# EAGLE design Controller V1 (EAGLE 9.3.2)
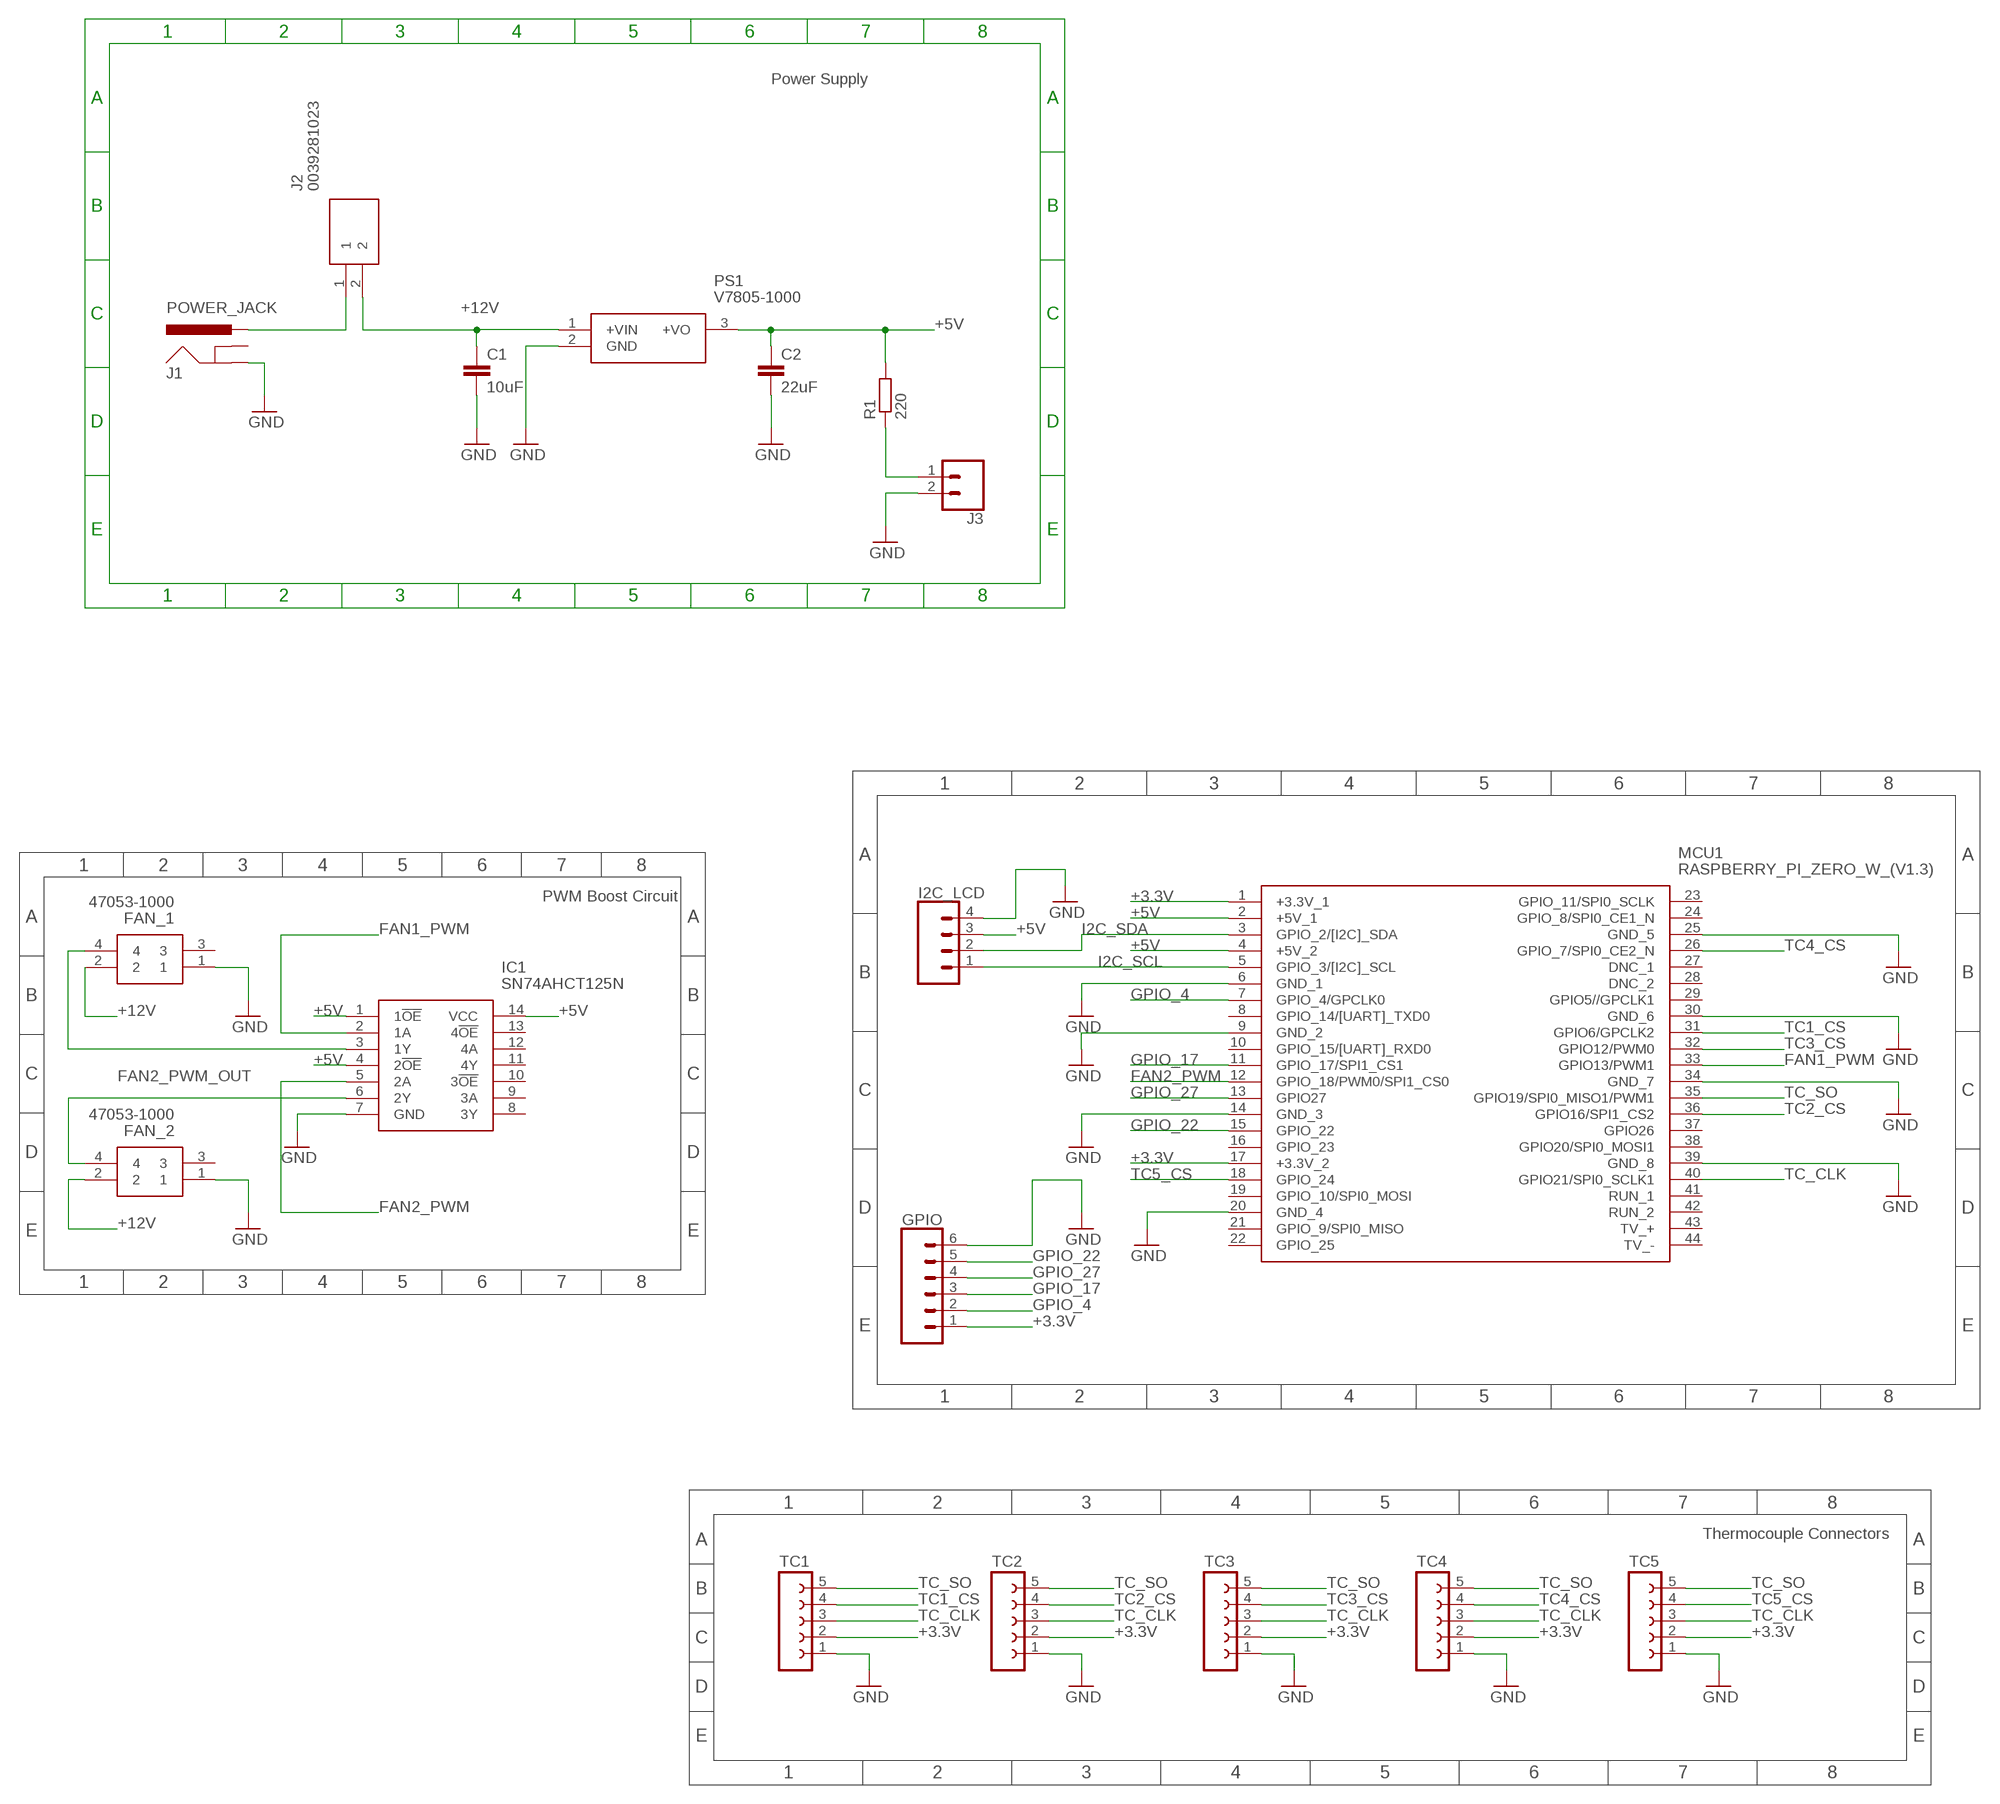
[diagram p0: schematic, sheet 1]

## Parts
C1  10uF  C-EU050-024X044  [C050-024X044]
C2  22uF  C-EU050-024X044  [C050-024X044]
FAN_1  47053-1000  [47053-1000]
FAN_2  47053-1000  [47053-1000]
GPIO  CONN_06SILK_FEMALE_PTH  [1X06]
I2C_LCD  CONN_04PTH  [1X04]
IC1  SN74AHCT125N  [DIP794W53P254L1930H508Q14N]
J1  POWER_JACK  [POWER_JACK_PTH]
J2  0039281023  [SHDR2W145P0X550_1X2_960X540X13]
J3  CONN_02  [1X02]
MCU1  RASPBERRY_PI_ZERO_W_(V1.3)  [RASPBERRYPIZEROWV13]
PS1  V7805-1000  [V78031500]
R1  220  R-EU_0309/10  [0309/10]
TC1  FE05-1  [FE05-1]
TC2  FE05-1  [FE05-1]
TC3  FE05-1  [FE05-1]
TC4  FE05-1  [FE05-1]
TC5  FE05-1  [FE05-1]

## Nets
+3.3V: GPIO.1 MCU1.1(+3.3V_1) MCU1.17(+3.3V_2) TC1.2 TC2.2 TC3.2 TC4.2 TC5.2
+5V: C2.1 I2C_LCD.3 IC1.1(1!OE) IC1.4(2!OE) IC1.14(VCC) MCU1.2(+5V_1) MCU1.4(+5V_2) PS1.3(+VO) R1.2
+12V: C1.1 FAN_1.2 FAN_2.2 J2.2 PS1.1(+VIN)
FAN1_PWM: IC1.2(1A) MCU1.33(GPIO13/PWM1)
FAN2_PWM: IC1.5(2A) MCU1.12(GPIO_18/PWM0/SPI1_CS0)
FAN2_PWM_OUT: FAN_2.4 IC1.6(2Y)
FAN!_PWM_OUT: FAN_1.4 IC1.3(1Y)
GND: C1.2 C2.2 FAN_1.1 FAN_2.1 GPIO.6 I2C_LCD.4 IC1.7(GND) J1.GND J3.2 MCU1.6(GND_1) MCU1.9(GND_2) MCU1.14(GND_3) MCU1.20(GND_4) MCU1.25(GND_5) MCU1.30(GND_6) MCU1.34(GND_7) MCU1.39(GND_8) PS1.2(GND) TC1.1 TC2.1 TC3.1 TC4.1 TC5.1
GPIO_4: GPIO.2 MCU1.7(GPIO_4/GPCLK0)
GPIO_17: GPIO.3 MCU1.11(GPIO_17/SPI1_CS1)
GPIO_22: GPIO.5 MCU1.15(GPIO_22)
GPIO_27: GPIO.4 MCU1.13(GPIO27)
I2C_SCL: I2C_LCD.1 MCU1.5(GPIO_3/[I2C]_SCL)
I2C_SDA: I2C_LCD.2 MCU1.3(GPIO_2/[I2C]_SDA)
N$1: J3.1 R1.1
TC1_CS: MCU1.31(GPIO6/GPCLK2) TC1.4
TC2_CS: MCU1.36(GPIO16/SPI1_CS2) TC2.4
TC3_CS: MCU1.32(GPIO12/PWM0) TC3.4
TC4_CS: MCU1.26(GPIO_7/SPI0_CE2_N) TC4.4
TC5_CS: MCU1.18(GPIO_24) TC5.4
TC_CLK: MCU1.40(GPIO21/SPI0_SCLK1) TC1.3 TC2.3 TC3.3 TC4.3 TC5.3
TC_SO: MCU1.35(GPIO19/SPI0_MISO1/PWM1) TC1.5 TC2.5 TC3.5 TC4.5 TC5.5
VIN: J1.PWR J2.1
Unconnected: FAN_1.3 FAN_2.3 IC1.8(3Y) IC1.9(3A) IC1.10(3!OE) IC1.11(4Y) IC1.12(4A) IC1.13(4!OE) J1.GNDBREAK MCU1.8(GPIO_14/[UART]_TXD0) MCU1.10(GPIO_15/[UART]_RXD0) MCU1.16(GPIO_23) MCU1.19(GPIO_10/SPI0_MOSI) MCU1.21(GPIO_9/SPI0_MISO) MCU1.22(GPIO_25) MCU1.23(GPIO_11/SPI0_SCLK) MCU1.24(GPIO_8/SPI0_CE1_N) MCU1.27(DNC_1) MCU1.28(DNC_2) MCU1.29(GPIO5//GPCLK1) MCU1.37(GPIO26) MCU1.38(GPIO20/SPI0_MOSI1) MCU1.41(RUN_1) MCU1.42(RUN_2) MCU1.43(TV_+) MCU1.44(TV_-)

## Notes on the sheet
- Power Supply
- PWM Boost Circuit
- Thermocouple Connectors

## Library data of the parts
C1 C2 = rcl:C-EU: CAPACITOR, European symbol; SPICEPREFIX: C
FAN_1 FAN_2 = SamacSys_Parts:47053-1000: MOLEX - 47053-1000 - HEADER, 4POS, 1ROW, 2.54MM Source: Datasheet <https://componentsearchengine.com/Datasheets/1/47053-1000.pdf>; DESCRIPTION: MOLEX - 47053-1000 - HEADER, 4POS, 1ROW, 2.54MM; HEIGHT: mm; MANUFACTURER_NAME: Molex; MANUFACTURER_PART_NUMBER: 47053-1000; MOUSER_PART_NUMBER: 538-47053-1000; MOUSER_PRICE-STOCK: https://www.mouser.com/Search/Refine.aspx?Keyword=538-47053-1000
GPIO = SparkFun-Connectors:CONN_06: Multi connection point. Often used as Generic Header-pin footprint for 0.1 inch spaced/style header connections On any of the 0.1 inch spaced packages, you can populate with these: Break Away Headers - Straight <https://www.sparkfun.com/products/116> (PRT-00116) Break Away Male Headers - Right Angle <https://www.sparkfun.com/products/553> (PRT-00553) Female Headers <https://www.sparkfun.com/products/115> (PRT-00115) Break Away Headers - Machine Pin <https://www.sparkfun.com/products/117> (PRT-00117) Break Away Female Headers - Swiss Machine Pin <https://www.sparkfun.com/products/743> (PRT-00743) Arduino Stackable Header - 6 Pin <https://www.sparkfun.com/products/9280> (PRT-09280) For SCREWTERMINALS and SPRING TERMINALS visit here: Screw Terimnals on SparkFun.com <https://www.sparkfun.com/search/results?term=Screw+Terminals> (5mm/3.5mm/2.54mm spacing) This device is also useful as a general connection point to wire up your design to another part of your project. Our various solder wires solder well into these plated through hole pads. Hook-Up Wire - Assortment (Stranded, 22 AWG) <https://www.sparkfun.com/products/11375> (PRT-11375) Hook-Up Wire - Assortment (Solid Core, 22 AWG) <https://www.sparkfun.com/products/11367> (PRT-11367) View the entire wire category on our website here <https://www.sparkfun.com/categories/141>; PROD_ID: CONN-08437
I2C_LCD = SparkFun-Connectors:CONN_04: Multi connection point. Often used as Generic Header-pin footprint for 0.1 inch spaced/style header connections On any of the 0.1 inch spaced packages, you can populate with these: Break Away Headers - Straight <https://www.sparkfun.com/products/116> (PRT-00116) Break Away Male Headers - Right Angle <https://www.sparkfun.com/products/553> (PRT-00553) Female Headers <https://www.sparkfun.com/products/115> (PRT-00115) Break Away Headers - Machine Pin <https://www.sparkfun.com/products/117> (PRT-00117) Break Away Female Headers - Swiss Machine Pin <https://www.sparkfun.com/products/743> (PRT-00743) For SCREWTERMINALS and SPRING TERMINALS visit here: Screw Terimnals on SparkFun.com <https://www.sparkfun.com/search/results?term=Screw+Terminals> (5mm/3.5mm/2.54mm spacing) This device is also useful as a general connection point to wire up your design to another part of your project. Our various solder wires solder well into these plated through hole pads. Hook-Up Wire - Assortment (Stranded, 22 AWG) <https://www.sparkfun.com/products/11375> (PRT-11375) Hook-Up Wire - Assortment (Solid Core, 22 AWG) <https://www.sparkfun.com/products/11367> (PRT-11367) View the entire wire category on our website here <https://www.sparkfun.com/categories/141> Special notes: Molex polarized connector foot print use with SKU : PRT-08231 with associated crimp pins and housings. 1MM SMD Version SKU: PRT-10208; PROD_ID: CONN-09696
IC1 = SamacSys_Parts:SN74AHCT125N: Quadruple Bus Buffer Gates With 3-State Outputs Source: Datasheet <http://www.ti.com/lit/gpn/sn74ahct125>; DESCRIPTION: Quadruple Bus Buffer Gates With 3-State Outputs; HEIGHT: 5.08mm; MANUFACTURER_NAME: Texas Instruments; MANUFACTURER_PART_NUMBER: SN74AHCT125N; MOUSER_PART_NUMBER: 595-SN74AHCT125N; MOUSER_PRICE-STOCK: https://www.mouser.com/Search/Refine.aspx?Keyword=595-SN74AHCT125N
J1 = SparkFun-Connectors:POWER_JACK: Power Jack Connector This is the standard 5.5mm barrel jack for power. The PTH is the most common, proven, reliable, footprint. The Slot footprint only works if the mill layer is transmitted to the PCB fab house so be warned. Here are the connectors we sell at SparkFun: DC Barrel Power Jack/Connector <https://www.sparkfun.com/products/119> (PRT-00119) DC Barrel Power Jack/Connector (SMD) <https://www.sparkfun.com/products/12748> (PRT-12748) DC Barrel Jack Adapter - Breadboard Compatible <https://www.sparkfun.com/products/10811> (PRT-10811) It is used on this SparkFun product (and many, many others): SparkFun RedBoard - Programmed with Arduino <https://www.sparkfun.com/products/12757> (DEV-12757) Also, if you need a mating power supply or connector, please check these out: Wall Adapter Power Supply - 9VDC 650mA <https://www.sparkfun.com/products/298> (TOL-00298) DC Barrel Jack Adapter - Male <https://www.sparkfun.com/products/10287> (PRT-10287); PROD_ID: CONN-08197
J2 = SamacSys_Parts:0039281023: Mini-Fit Jr. Vertical Header, 4.20mm Pitch, Dual Row, 2 Circuits, without Snap-in Plastic Peg PCB Lock, Tin, Natural Source: Datasheet <https://componentsearchengine.com/Datasheets/1/0039281023.pdf>; DESCRIPTION: Mini-Fit Jr. Vertical Header, 4.20mm Pitch, Dual Row, 2 Circuits, without Snap-in Plastic Peg PCB Lock, Tin, Natural; HEIGHT: 13.1mm; MANUFACTURER_NAME: Molex; MANUFACTURER_PART_NUMBER: 0039281023; MOUSER_PART_NUMBER: N/A; MOUSER_PRICE-STOCK: https://www.mouser.com/Search/Refine.aspx?Keyword=N%2FA
J3 = SparkFun-Connectors:CONN_02: Multi connection point. Often used as Generic Header-pin footprint for 0.1 inch spaced/style header connections On any of the 0.1 inch spaced packages, you can populate with these: Break Away Headers - Straight <https://www.sparkfun.com/products/116> (PRT-00116) Break Away Male Headers - Right Angle <https://www.sparkfun.com/products/553> (PRT-00553) Female Headers <https://www.sparkfun.com/products/115> (PRT-00115) Break Away Headers - Machine Pin <https://www.sparkfun.com/products/117> (PRT-00117) Break Away Female Headers - Swiss Machine Pin <https://www.sparkfun.com/products/743> (PRT-00743) For SCREWTERMINALS and SPRING TERMINALS visit here: Screw Terimnals on SparkFun.com <https://www.sparkfun.com/search/results?term=Screw+Terminals> (5mm/3.5mm/2.54mm spacing) This device is also useful as a general connection point to wire up your design to another part of your project. Our various solder wires solder well into these plated through hole pads. Hook-Up Wire - Assortment (Stranded, 22 AWG) <https://www.sparkfun.com/products/11375> (PRT-11375) Hook-Up Wire - Assortment (Solid Core, 22 AWG) <https://www.sparkfun.com/products/11367> (PRT-11367) View the entire wire category on our website here <https://www.sparkfun.com/categories/141> Special notes: Molex polarized connector foot print use with: PRT-08233 with associated crimp pins and housings. 2.54_SCREWTERM for use with PRT-10571. 3.5mm Screw Terminal footprints for PRT-08084 5mm Screw Terminal footprints for use with PRT-08432
MCU1 = SamacSys_Parts:RASPBERRY_PI_ZERO_W_(V1.3): Raspberry Pi Zero W (v1.3) Single-board Computers Source: Datasheet <https://cdn.sparkfun.com/assets/learn_tutorials/6/7/6/PiZero_1.pdf>; DESCRIPTION: Raspberry Pi Zero W (v1.3) Single-board Computers; HEIGHT: mm; MANUFACTURER_NAME: RASPBERRY-PI; MANUFACTURER_PART_NUMBER: Raspberry Pi Zero W (v1.3)
PS1 = SamacSys_Parts:V7805-1000: V7805-1000-SMT Non-Isolated DC/DC Converters Non-Isolated D C-DC Cnvrt. This is the SMT Version of the package. Source: Datasheet <https://componentsearchengine.com/Datasheets/1/V7805-1000.pdf>; DESCRIPTION: V7805-1000-SMT Non-Isolated DC/DC Converters Non-Isolated D C-DC Cnvrt. This is the SMT Version of the package.; HEIGHT: mm; MANUFACTURER_NAME: CUI; MANUFACTURER_PART_NUMBER: V7805-1000; MOUSER_PART_NUMBER: 490-V7805-1000; MOUSER_PRICE-STOCK: https://www.mouser.com/Search/Refine.aspx?Keyword=490-V7805-1000
R1 = rcl:R-EU_: RESISTOR, European symbol; SPICEPREFIX: R
TC1-TC5 = con-lsta:FE05-1: FEMALE HEADER; OC_FARNELL: unknown; OC_NEWARK: unknown

## Board
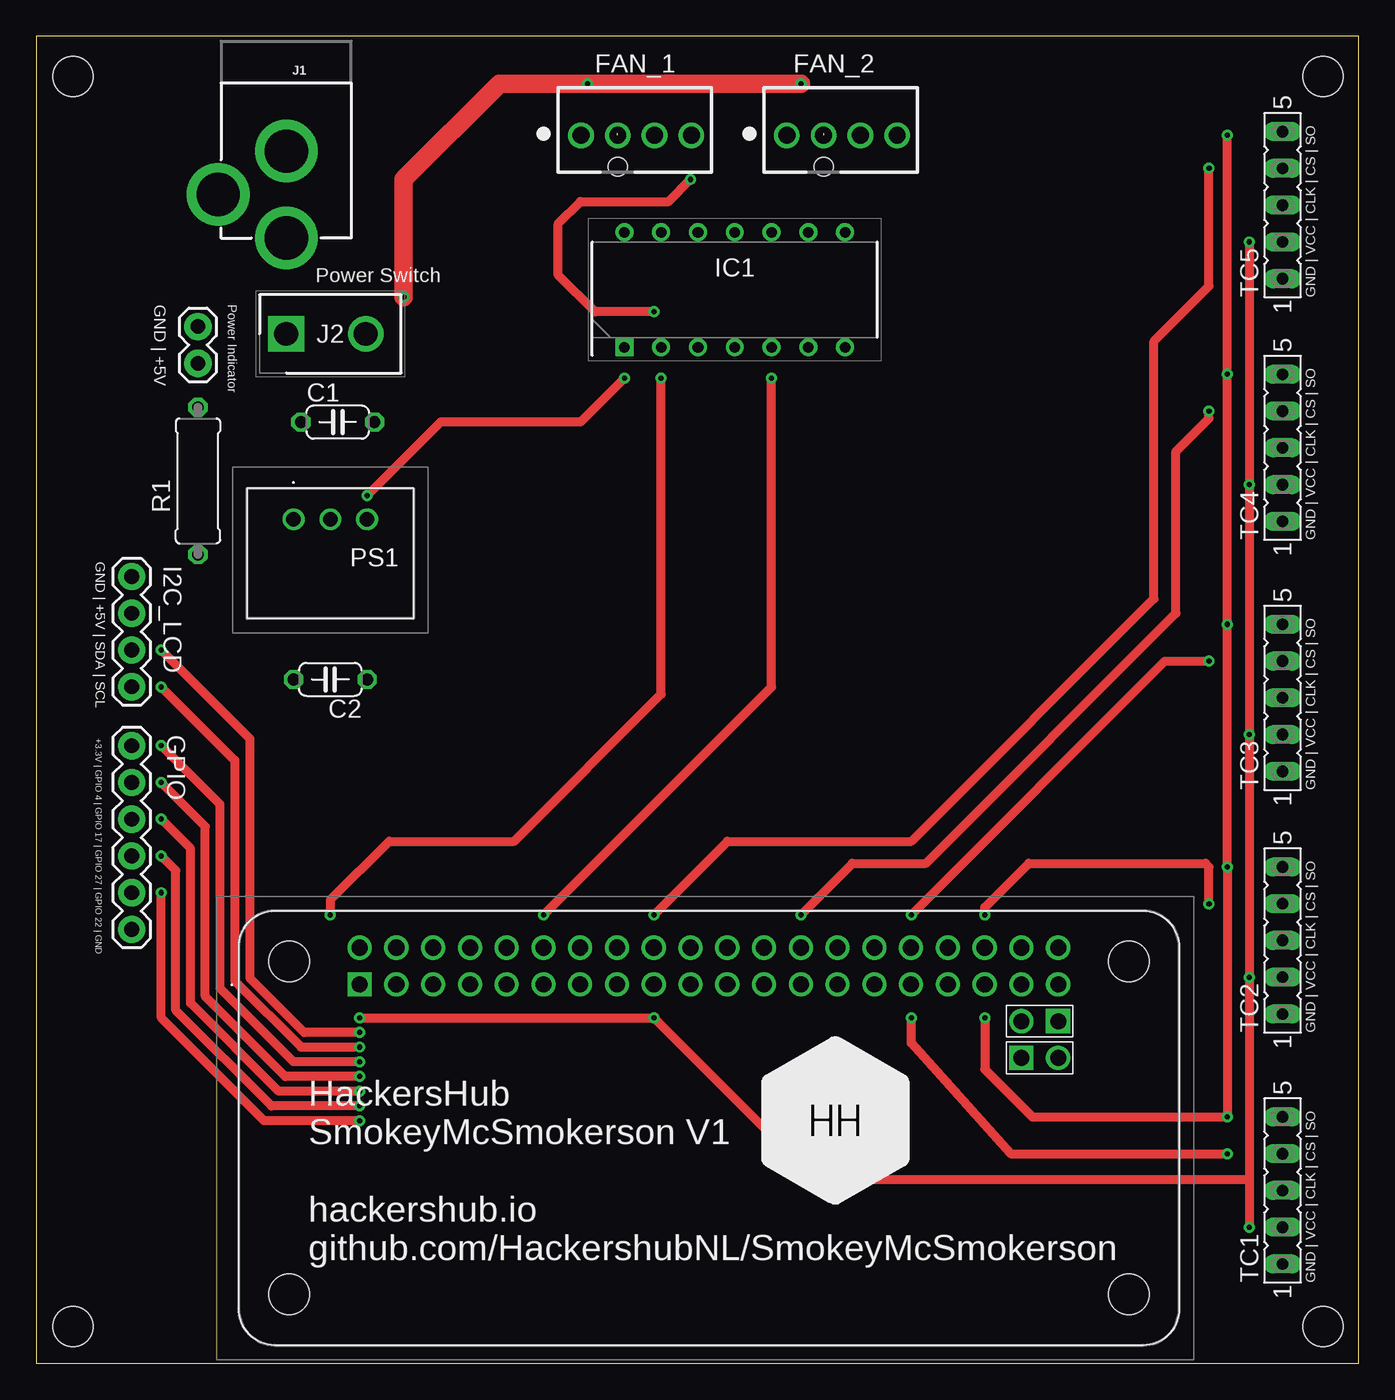
[diagram p1: board, top side]
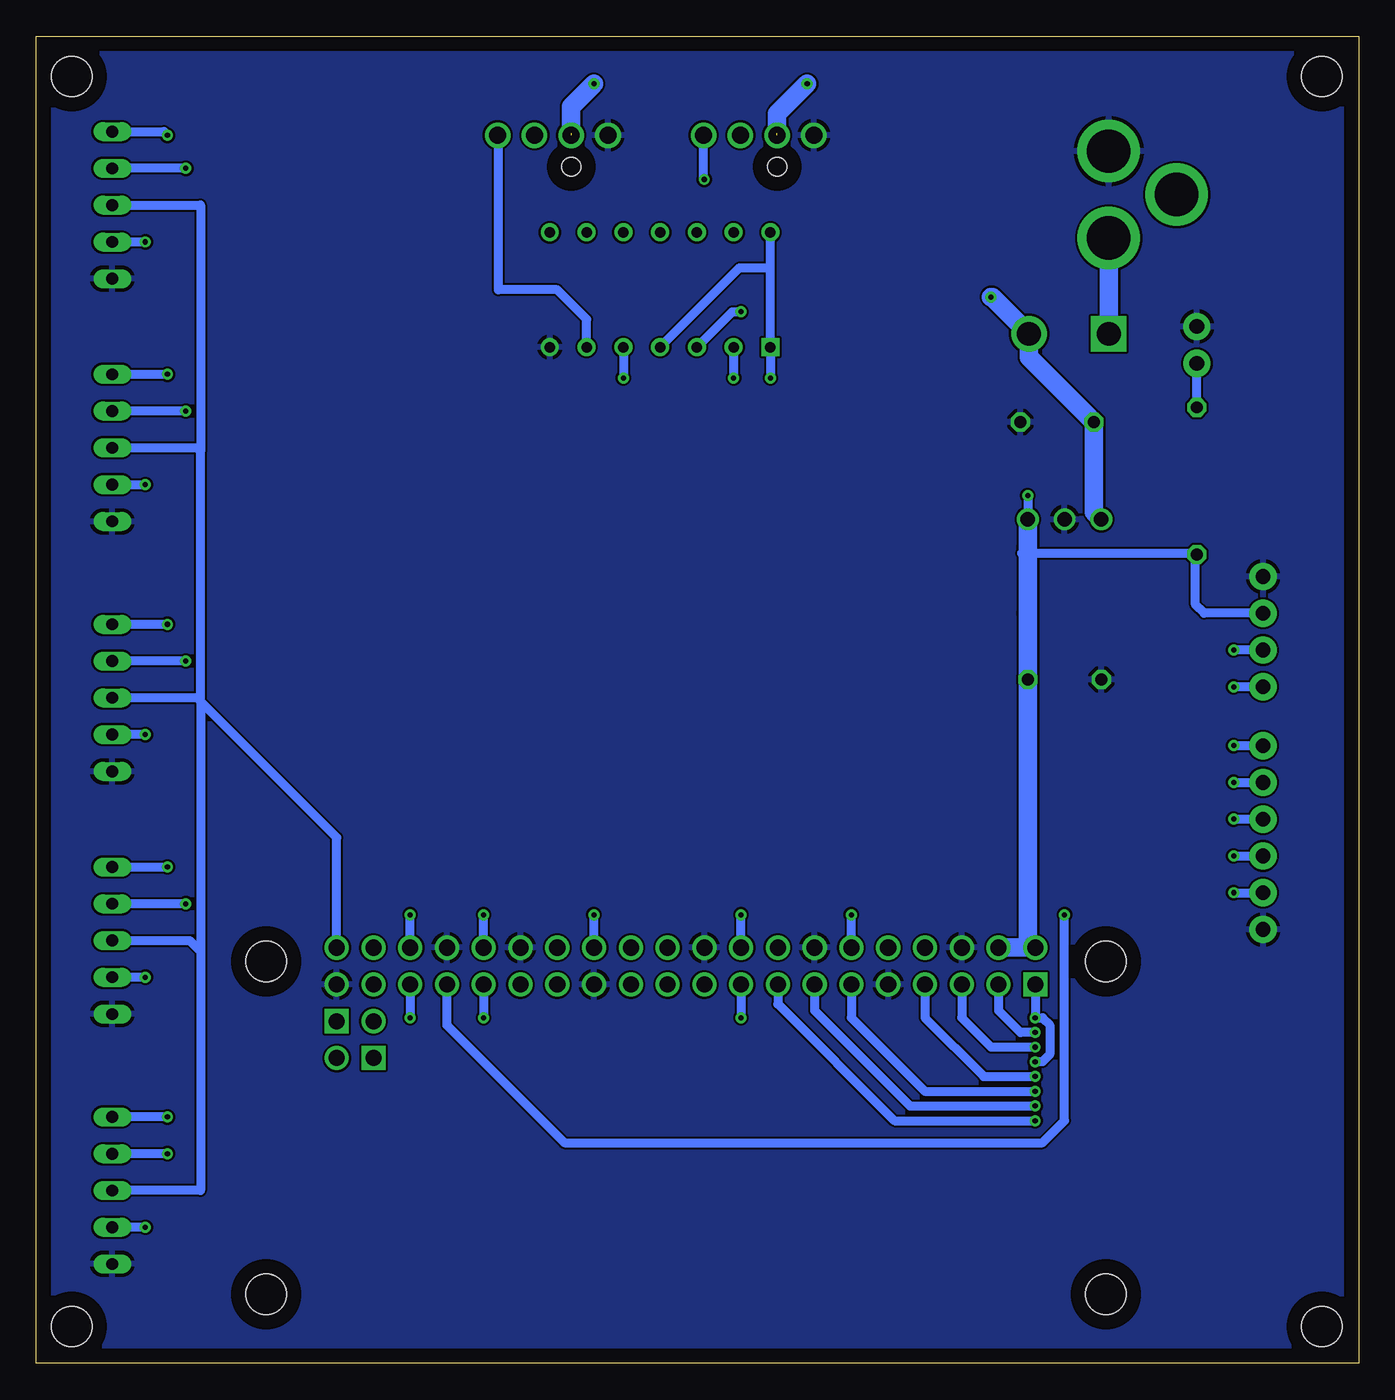
[diagram p2: board, bottom side, seen from below]

Size 91.36 x 91.68 mm. Coordinates in mm from the lower left corner, seen from the top.
Outline: 0,0 91.36,0 91.36,91.68 0,91.68 0,0
Copper layers (1*16): Top 0.035mm / dielectric 1.5mm / Bottom 0.035mm
Design rules "default": minimum track width 6mil, minimum drill 0.35mm, track to track 6mil, track to pad 6mil, pad to pad 6mil, via to via 6mil, smd to smd 6mil, copper to edge 40mil, drill to drill 6mil, minimum pad ring 10mil, minimum via ring 8mil, stop-mask expansion 4mil, vias tented up to drill 0mil, thermal gap 10mil
Holes 2.79 mm at 2.54,2.54 88.9,2.54 2.54,88.9 88.9,88.9

### Footprints (pad centres in the part's own frame; a part is rotated, then mirrored left to right if it is on the bottom)
C050-024X044 = drill 0.813 octagon: 1 -2.54,0; 2 2.54,0
47053-1000 = drill 1.17 pad 1.77: 1 1.57,2.54; 2 4.11,2.54; 3 6.65,2.54; 4 9.19,2.54 | hole 1.3: 4.11,0.38
1X06 = drill 1.016 pad 1.88: 1 0,0; 2 2.54,0; 3 5.08,0; 4 7.62,0; 5 10.16,0; 6 12.7,0
1X04 = drill 1.016 pad 1.88: 1 0,0; 2 2.54,0; 3 5.08,0; 4 7.62,0
DIP794W53P254L1930H508Q14N = drill 0.73 pad 1.13 square: 1 -3.97,7.62 | drill 0.73 pad 1.13: 2 -3.97,5.08; 3 -3.97,2.54; 4 -3.97,0; 5 -3.97,-2.54; 6 -3.97,-5.08; 7 -3.97,-7.62; 8 3.97,-7.62; 9 3.97,-5.08; 10 3.97,-2.54; 11 3.97,0; 12 3.97,2.54; 13 3.97,5.08; 14 3.97,7.62
POWER_JACK_PTH = drill 2.997 pad 4.318: GND 0,7.7; GNDBREAK 4.7,10.7; PWR 0,13.7
SHDR2W145P0X550_1X2_960X540X13 = drill 1.65 pad 2.475 square: 1 0,0 | drill 1.65 pad 2.475: 2 -5.5,0
1X02 = drill 1.016 pad 1.88: 1 0,0; 2 2.54,0
RASPBERRYPIZEROWV13 = drill 1.11 pad 1.665 square: 1 -23.885,9.92; 41 24.375,7.38; 43 21.835,4.84 | drill 1.11 pad 1.665: 2 -23.885,12.46; 3 -21.345,9.92; 4 -21.345,12.46; 5 -18.805,9.92; 6 -18.805,12.46; 7 -16.265,9.92; 8 -16.265,12.46; 9 -13.725,9.92; 10 -13.725,12.46; 11 -11.185,9.92; 12 -11.185,12.46; 13 -8.645,9.92; 14 -8.645,12.46; 15 -6.105,9.92; 16 -6.105,12.46; 17 -3.565,9.92; 18 -3.565,12.46; 19 -1.025,9.92; 20 -1.025,12.46; 21 1.515,9.92; 22 1.515,12.46; 23 4.055,9.92; 24 4.055,12.46; 25 6.595,9.92; 26 6.595,12.46; 27 9.135,9.92; 28 9.135,12.46; 29 11.675,9.92; 30 11.675,12.46; 31 14.215,9.92; 32 14.215,12.46; 33 16.755,9.92; 34 16.755,12.46; 35 19.295,9.92; 36 19.295,12.46; 37 21.835,9.92; 38 21.835,12.46; 39 24.375,9.92; 40 24.375,12.46; 42 21.835,7.38; 44 24.375,4.84 | hole 2.8: -28.755,11.5; -28.755,-11.5; 29.245,-11.5; 29.245,11.5
V78031500 = drill 1 pad 1.5: 1 -2.54,-2.15; 2 0,-2.15; 3 2.54,-2.15
0309/10 = drill 0.813 octagon: 1 -5.08,0; 2 5.08,0
FE05-1 = drill 0.813 long: 1 -5.08,0; 2 -2.54,0; 3 0,0; 4 2.54,0; 5 5.08,0

### Placement (x,y rotation side)
C1  20.83,65.02 0 top
C2  20.32,47.24 180 top
FAN_1  36.07,82.3 0 top
FAN_2  50.29,82.3 0 top
GPIO  6.6,42.67 270 top
I2C_LCD  6.6,46.74 90 top
IC1  48.26,74.17 90 top
J1  17.27,91.44 180 top
J2  17.27,71.12 180 top
J3  11.18,69.09 90 top
MCU1  46.23,16.26 0 top
PS1  20.32,60.45 0 top
R1  11.18,60.96 270 top
TC1  86.11,11.94 90 top
TC2  86.11,29.21 90 top
TC3  86.11,45.97 90 top
TC4  86.11,63.25 90 top
TC5  86.11,80.01 90 top

### Tracks (layer width: path | path; a pad name or v marks a point on that pad's centre or on a via)
+3.3V  (via drill 0.35)
  Top 0.61: 83.82,12.7 v83.82,26.67 v83.82,43.43 v83.82,60.71 v83.82,77.47 | 83.82,12.7 v83.82,9.4 | v22.35,23.88 v42.67,23.88 53.85,12.7 83.82,12.7 | v22.35,20.83 17.78,20.83 12.7,25.91 12.7,38.61 v8.64,42.67
  Bottom 0.61: v83.82,9.4 TC1.2 | v83.82,26.67 TC2.2 | v83.82,43.43 TC3.2 | v83.82,77.47 TC5.2 | TC4.2 v83.82,60.71 | MCU1.1 v22.34,23.89 v22.35,23.88 21.84,23.88 21.34,23.37 21.34,21.34 21.84,20.83 v22.35,20.83 | MCU1.17 42.67,26.17 v42.67,23.88 | v8.64,42.67 GPIO.1
+5V  (via drill 0.35)
  Top 0.61: v40.64,68.07 37.59,65.02 27.94,65.02 v22.86,59.94
  Bottom 0.61: 40.64,75.69 IC1.1 v40.64,68.07 | 40.64,75.69 IC1.14 | IC1.4 42.77,75.69 40.64,75.69 | 22.86,56.39 23.27,55.97 11.27,55.97 | MCU1.2 22.34,29.24 | 11.27,55.97 R1.2 | I2C_LCD.3 10.67,51.82 11.27,52.42 11.27,55.97 | v22.86,59.94 PS1.3
  Bottom 1.27: PS1.3 22.86,56.39 C2.1 | 22.86,51.82 C2.1 | C2.1 22.86,29.23 MCU1.2 MCU1.4
+12V  (via drill 0.35)  (2 unrouted)
  Top 1.27: v25.4,73.66 25.4,81.79 32,88.39 v38.1,88.39 v52.83,88.39
  Bottom 1.27: PS1.1 18.29,58.81 C1.1 22.77,69.51 J2.2 25.31,73.66 v25.4,73.66 | v38.1,88.39 40.18,86.31 40.18,84.98 | v52.83,88.39 54.4,86.82 54.4,84.98
FAN1_PWM  (via drill 0.35)
  Top 0.61: v43.18,68.07 43.18,46.23 33.02,36.07 24.38,36.07 20.32,32 v20.32,30.99
  Bottom 0.61: MCU1.33 62.98,23.36 54.86,15.24 21.84,15.24 20.32,16.76 v20.32,30.99 | IC1.2 v43.18,68.07
FAN2_PWM  (via drill 0.35)
  Top 0.61: v35.05,30.99 50.8,46.74 v50.8,68.07
  Bottom 0.61: IC1.5 v50.8,68.07 | MCU1.12 35.05,28.73 v35.05,30.99
FAN2_PWM_OUT
  Bottom 0.61: IC1.6 53.34,72.14 55.37,74.17 59.44,74.17 59.44,84.79 FAN_2.4
FAN!_PWM_OUT  (via drill 0.35)
  Top 0.61: v42.67,72.64 38.61,72.64 36.07,75.18 36.07,78.74 37.59,80.26 43.69,80.26 v45.21,81.79
  Bottom 0.61: IC1.3 43.27,72.64 v42.67,72.64 | v45.21,81.79 45.26,81.83 FAN_1.4
GND
  pour Bottom: 0,91.44 91.44,91.44 91.44,0 0,0
GPIO_4  (via drill 0.35)
  Top 0.61: v8.64,40.13 11.68,37.08 11.68,25.34 17.21,19.81 v22.35,19.81
  Bottom 0.61: MCU1.7 29.96,23.87 25.91,19.81 v22.35,19.81 | v8.64,40.13 GPIO.2
GPIO_17  (via drill 0.35)
  Top 0.61: v22.35,18.8 16.76,18.8 10.67,24.89 10.67,35.56 v8.64,37.59
  Bottom 0.61: MCU1.11 35.04,23.87 29.97,18.8 v22.35,18.8 | v8.64,37.59 GPIO.3
GPIO_22  (via drill 0.35)
  Top 0.61: v22.35,16.76 15.75,16.76 8.64,23.88 v8.64,32.51
  Bottom 0.61: v22.35,16.76 32.07,16.76 40.12,24.82 MCU1.15 | v8.64,32.51 GPIO.5
GPIO_27  (via drill 0.35)
  Top 0.61: v22.35,17.78 16.26,17.78 9.65,24.38 9.65,34.04 v8.64,35.05
  Bottom 0.61: MCU1.13 37.58,24.38 30.99,17.78 v22.35,17.78 | v8.64,35.05 GPIO.4
I2C_SCL  (via drill 0.35)
  Top 0.61: v8.64,46.74 13.72,41.66 13.72,26.42 18.29,21.84 v22.35,21.84
  Bottom 0.61: MCU1.5 27.42,23.87 25.4,21.84 v22.35,21.84 | I2C_LCD.1 v8.64,46.74
I2C_SDA  (via drill 0.35)
  Top 0.61: v8.64,49.28 14.75,43.16 14.75,26.63 18.52,22.86 v22.35,22.86
  Bottom 0.61: MCU1.3 24.88,24.38 23.37,22.86 v22.35,22.86 | I2C_LCD.2 v8.64,49.28
N$1
  Bottom 0.61: R1.1 J3.1
TC1_CS  (via drill 0.35)
  Top 0.61: v82.3,14.48 67.32,14.48 60.45,22.13 v60.45,23.88
  Bottom 0.61: v82.3,14.48 TC1.4 | MCU1.31 60.45,26.17 v60.45,23.88
TC2_CS  (via drill 0.35)
  Top 0.61: v81.03,31.75 81.03,34.29 80.77,34.54 68.58,34.54 65.53,31.5 v65.53,30.99
  Bottom 0.61: v81.03,31.75 TC2.4 | MCU1.36 65.53,28.73 v65.53,30.99
TC3_CS  (via drill 0.35)
  Top 0.61: v81.03,48.51 77.98,48.51 v60.45,30.99
  Bottom 0.61: v81.03,48.51 TC3.4 | MCU1.32 60.44,30.98 v60.45,30.99
TC4_CS  (via drill 0.35)
  Top 0.61: v81.03,65.79 81.03,65.28 78.74,62.99 78.74,51.82 61.47,34.54 56.39,34.54 v52.83,30.99
  Bottom 0.61: v81.03,65.79 TC4.4 | MCU1.26 52.83,28.73 v52.83,30.99
TC5_CS  (via drill 0.35)
  Top 0.61: v42.67,30.99 47.75,36.07 60.45,36.07 77.22,52.83 77.22,70.61 81.03,74.42 v81.03,82.55
  Bottom 0.61: v81.03,82.55 TC5.4 | MCU1.18 42.66,30.98 v42.67,30.99
TC_CLK
  Bottom 0.61: 80.01,45.72 70.6,36.31 MCU1.40 | 80.01,45.72 80.01,45.97 | 80.01,45.72 80.01,28.45 | 80.01,28.45 80.01,11.94 TC1.3 | 80.01,45.97 80.01,62.99 | 80.01,62.99 80.01,80.01 TC5.3 | 80.01,45.97 TC3.3 | TC4.3 80.26,63.25 80.01,62.99 | TC2.3 80.77,29.21 80.01,28.45
TC_SO  (via drill 0.35)
  Top 0.61: v82.3,84.84 v82.3,68.33 v82.3,51.05 v82.3,34.29 v82.3,17.02 68.83,17.02 65.53,20.32 v65.53,23.88
  Bottom 0.61: v82.3,17.02 TC1.5 | v82.3,51.05 TC3.5 | TC4.5 v82.3,68.33 | TC5.5 82.55,85.09 v82.3,84.84 | TC2.5 v82.3,34.29 | MCU1.35 v65.52,23.89 v65.53,23.88
VIN
  Bottom 1.27: J1.PWR J2.1

### Text on the board
tNames: Power Switch | GND | VCC | CLK | CS | SO | GND | +5V | Power Indicator | GND | VCC | CLK | CS | SO | GND | +5V | SDA | SCL | +3.3V | GPIO 4 | GPIO 17 | GPIO 27 | GPIO 22 | GND | GND | VCC | CLK | CS | SO | GND | VCC | CLK | CS | SO | HackersHub / SmokeyMcSmokerson V1 / / hackershub.io / github.com/HackershubNL/SmokeyMcSmokerson | GND | VCC | CLK | CS | SO